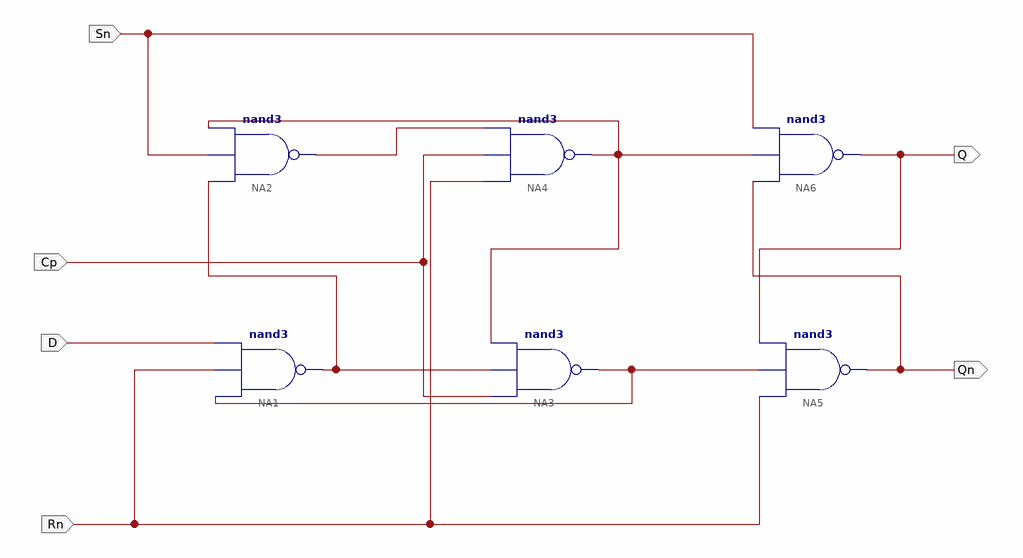
[diagram p0: schematic sheet 1]
// Xilinx ISE schematic MB_DFF.sch (kintex7) as structural Verilog: 6 symbols, 6 ports
module MB_DFF (
  input  Sn,
  input  Rn,
  input  D,
  input  Cp,
  output Q,
  output Qn
);

  wire XLXN_1, XLXN_22, XLXN_24, XLXN_25;

  nand NA2 (XLXN_1, XLXN_22, Sn, XLXN_24);
  nand NA4 (XLXN_24, Rn, Cp, XLXN_1);
  nand NA6 (Q, Qn, XLXN_24, Sn);
  nand NA1 (XLXN_22, XLXN_25, Rn, D);
  nand NA3 (XLXN_25, Cp, XLXN_22, XLXN_24);
  nand NA5 (Qn, Rn, XLXN_25, Q);
endmodule
